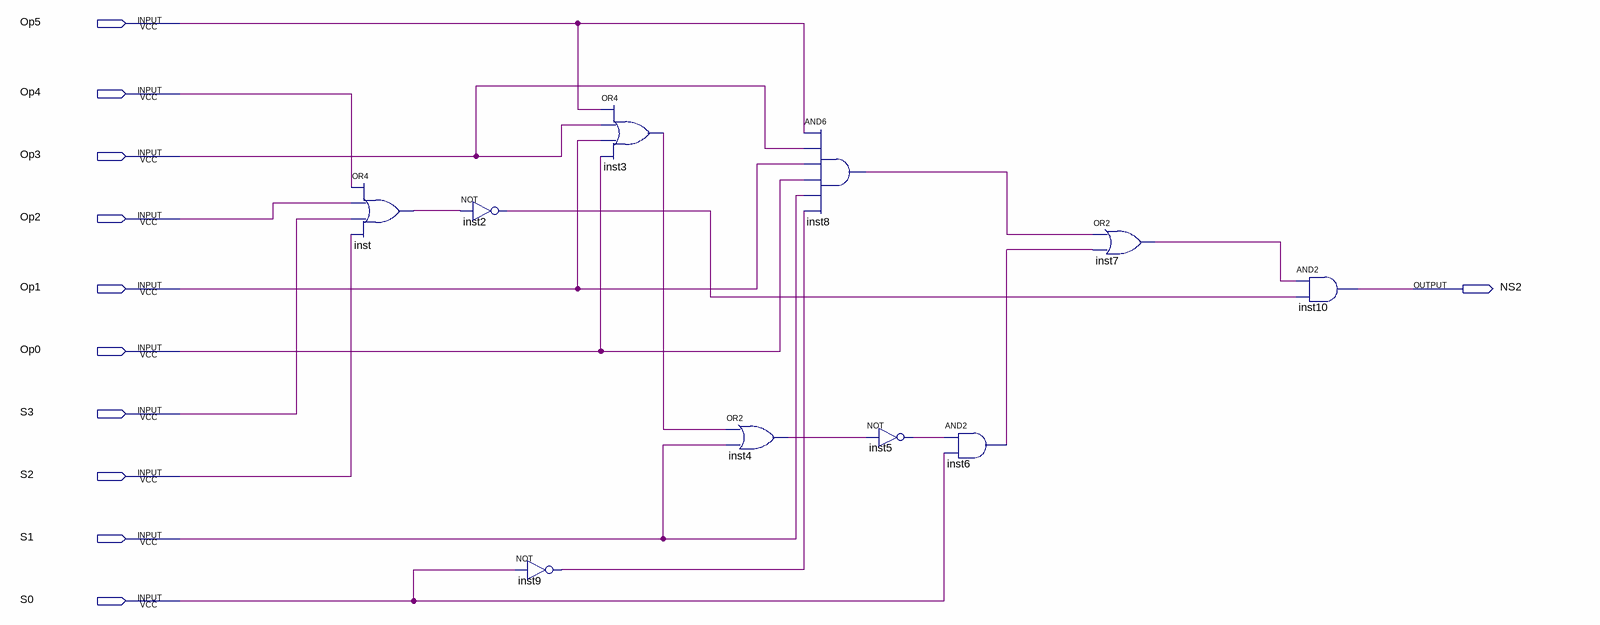
[diagram p0: schematic sheet]
// Quartus schematic NS2.bdf as structural Verilog: 10 symbols, 11 pins
module NS2 (
  input  Op5,
  input  Op4,
  input  Op3,
  input  Op2,
  input  Op1,
  input  Op0,
  input  S3,
  input  S2,
  input  S1,
  input  S0,
  output NS2
);

  wire inst2_out, inst3_out, inst4_out, inst5_out, inst6_out, inst7_out, inst8_out, inst9_out, inst_out;

  or inst (inst_out, Op4, Op2, S3, S2);
  not inst2 (inst2_out, inst_out);
  not inst9 (inst9_out, S0);
  or inst3 (inst3_out, Op5, Op3, Op1, Op0);
  or inst4 (inst4_out, inst3_out, S1);
  and inst8 (inst8_out, Op5, Op3, Op1, Op0, S1, inst9_out);
  not inst5 (inst5_out, inst4_out);
  and inst6 (inst6_out, inst5_out, S0);
  or inst7 (inst7_out, inst8_out, inst6_out);
  and inst10 (NS2, inst7_out, inst2_out);
endmodule
